# EasyEDA Pro project ProDoc_ChisFlash-MBC5-Plus-v1.21_8M.epro

# Schematic ChisFlash-MBC5-Plus-v1.21
Board Name: ChisFlash-MBC5-Plus-v1.21; Create Date: 2024-12-11; Page Name: 1; Project Name: ChisFlash-MBC5（GBC烧录卡）2; Schematic Name: ChisFlash-MBC5-Plus-v1.21; Update Date: 2024-12-11; Company: 嘉立创EDA; Page Size: A4; Version: V1.0
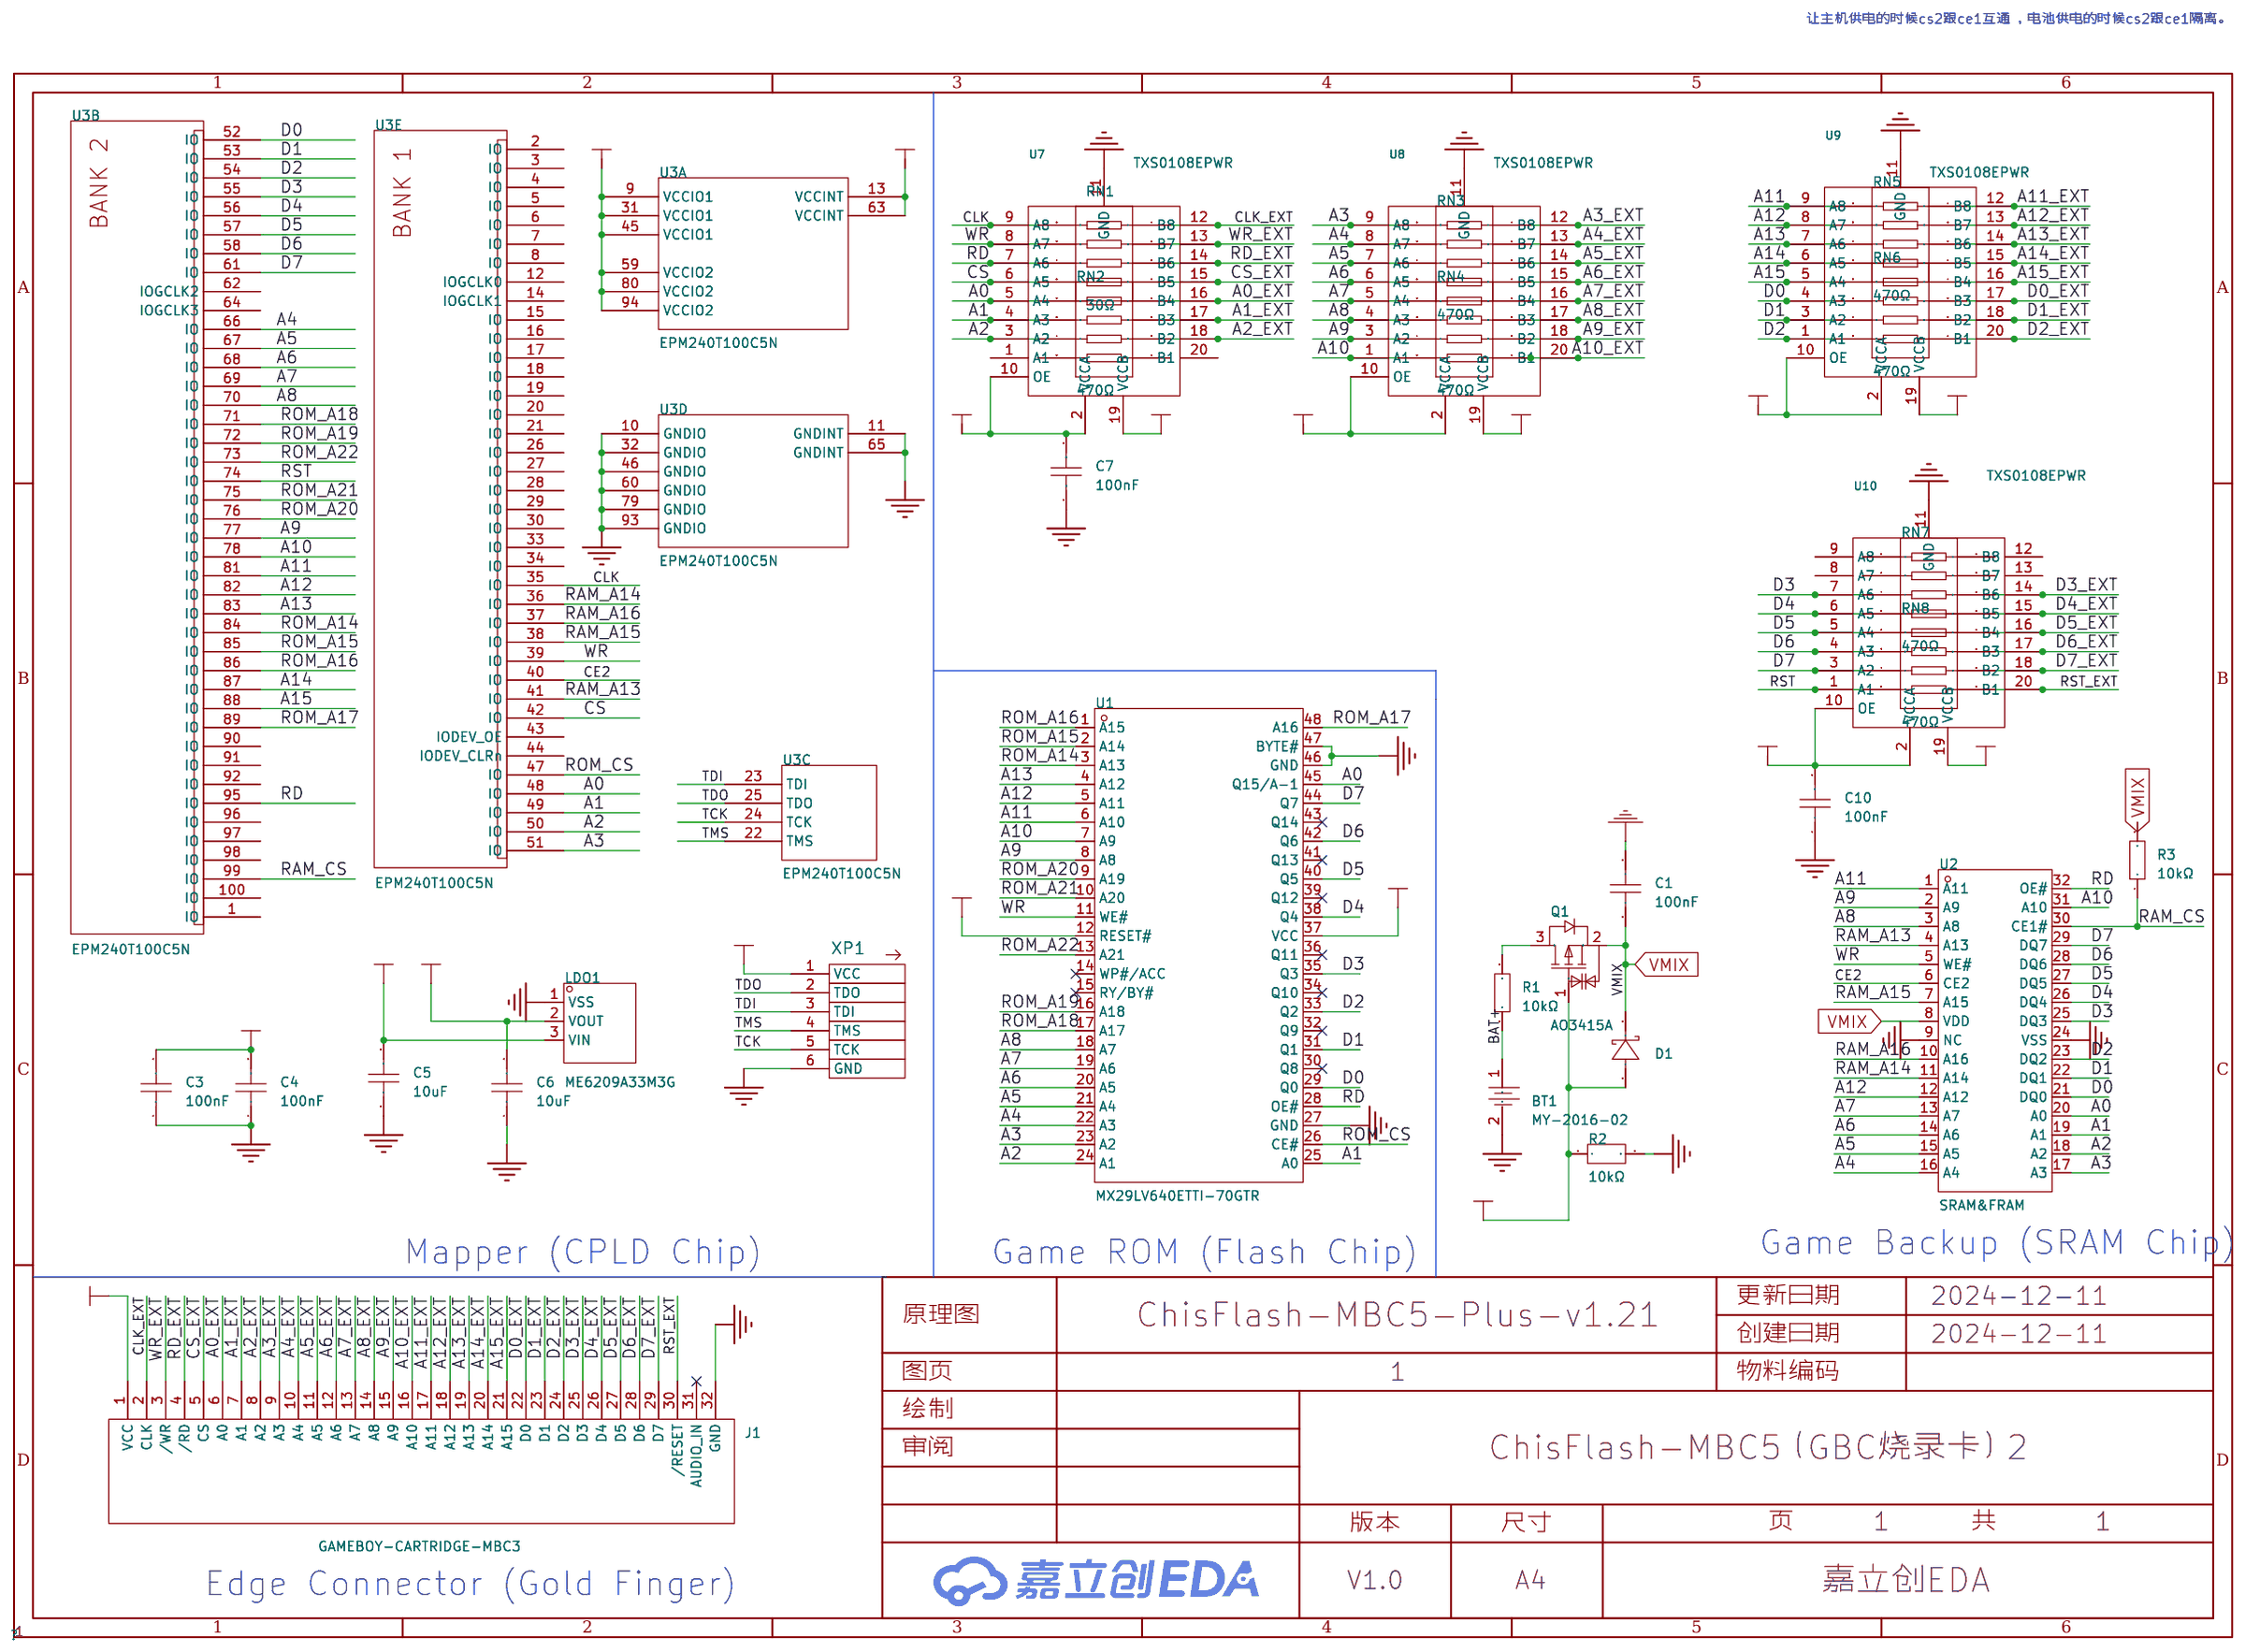
[diagram p0: schematic sheet]

## Parts
BT1  MY-2016-02  [BAT-SMD_MY-2032-08]
C1  100nF  [C0603]
C3  100nF  [C0603]
C4  100nF  [C0603]
C5  10uF  [C0603]
C6  10uF  [C0603]
C7  100nF  [C0603]
C10  100nF  [C0603]
D1  RB751V-40  [SOD-323_L1.7-W1.3-LS2.6-RD-1]
J1  GAMEBOY-CARTRIDGE-MBC3  [GAMEBOY_CARTRIDGE_PIN]
LDO1  ME6209A33M3G  [SOT-23-3_L2.9-W1.6-P1.90-LS2.8-BR]
Q1  AO3415A  [SOT-23-3_L3.0-W1.7-P0.95-LS2.9-BR]
R1  10kΩ  [R0603]
R2  10kΩ  [R0603]
R3  10kΩ  [R0603]
RN1  30Ω  [RES-ARRAY-SMD_0402-8P-L2.0-W1.0-BL]
RN2  470Ω  [RES-ARRAY-SMD_0402-8P-L2.0-W1.0-BL]
RN3  470Ω  [RES-ARRAY-SMD_0402-8P-L2.0-W1.0-BL]
RN4  470Ω  [RES-ARRAY-SMD_0402-8P-L2.0-W1.0-BL]
RN5  470Ω  [RES-ARRAY-SMD_0402-8P-L2.0-W1.0-BL]
RN6  470Ω  [RES-ARRAY-SMD_0402-8P-L2.0-W1.0-BL]
RN7  470Ω  [RES-ARRAY-SMD_0402-8P-L2.0-W1.0-BL]
RN8  470Ω  [RES-ARRAY-SMD_0402-8P-L2.0-W1.0-BL]
U1  MX29LV640ETTI-70GTR  [TSOP-48_L12.0-W18.4-P0.50-LS20.0-BL]
U2  SRAM&FRAM  [TSSOP-TSOP二合一]
U3  EPM240T100C5N  [TQFP-100_L14.0-W14.0-P0.50-LS16.0-BL]  (sections 1,2,3,4,5)
U7  TXS0108EPWR  [TSSOP-20_L6.5-W4.4-P0.65-LS6.4-BL]
U8  TXS0108EPWR  [TSSOP-20_L6.5-W4.4-P0.65-LS6.4-BL]
U9  TXS0108EPWR  [TSSOP-20_L6.5-W4.4-P0.65-LS6.4-BL]
U10  TXS0108EPWR  [TSSOP-20_L6.5-W4.4-P0.65-LS6.4-BL]
XP1  JTAG  [HDR-TH_6P-P1.27-V-M-1]  (no BOM)

## Library data of the parts
BT1 = MY-2016-02: 连接器类型:电池扣;适用电池规格:CR2016;触头材质:磷青铜;触点电镀:镍;工作温度范围:-25℃~+85℃;; LCSC Part Name: 电池扣 适用电池:CR2016; Supplier Part: C2979176; Manufacturer: MYOUNG(美阳); Supplier Footprint: SMD; JLCPCB Part Class: Extended Part; Datasheet: https://atta.szlcsc.com/upload/public/pdf/source/20220302/E5D3505CBEA02A6D68587A503653AA7C.pdf; Supplier: LCSC; Connector Type: 电池扣; Battery Type: CR2016; Contact Material: 磷青铜; Contact Plating: 镍; Operating Temperature Range: -25℃~+85℃
C1 C3 C4 C7 C10 = CGA0603X7R104K500JT: 容值:100nF;精度:±10%;额定电压:50V;材质(温度系数):X7R;; LCSC Part Name: 100nF ±10% 50V; Supplier Part: C6119867; Manufacturer: HRE(芯声); Supplier Footprint: 0603; JLCPCB Part Class: Extended Part; Supplier: LCSC; Tolerance: ±10%; Voltage Rated: 50V; Temperature Coefficient: X7R
C5 C6 = CL10A106MA8NRNC: 容值:10uF;精度:±20%;额定电压:25V;材质(温度系数):X5R;; LCSC Part Name: 10uF ±20% 25V; Supplier Part: C96446; Manufacturer: SAMSUNG(三星); Supplier Footprint: 0603; JLCPCB Part Class: 基础库; Datasheet: https://atta.szlcsc.com/upload/public/pdf/source/20160218/1457707763339.pdf; Supplier: LCSC; Tolerance: ±20%; Voltage Rated: 25V; Temperature Coefficient: X5R
D1 = RB751V-40_C7502691: 二极管配置:独立式;正向压降(Vf):370mV@1mA;直流反向耐压(Vr):40V;平均整流电流(Io):30mA;; LCSC Part Name: 电压:40V 电流:30mA; Supplier Part: C7502691; Manufacturer: 宏迦橙; Supplier Footprint: SOD-323; JLCPCB Part Class: Extended Part; Datasheet: https://atta.szlcsc.com/upload/public/pdf/source/20230828/92E6C0C5321000DDFDA2BB61EC3C00B5.pdf; Supplier: LCSC; Diode Configuration: 独立式; Forward Voltage (Vf@If): 370mV@1mA; Reverse Voltage (Vr): 40V; Average Rectified Current (Io): 30mA; Reverse Leakage Current (Ir): 500nA; Peak forward surge current: 200mA
J1 = GAMEBOY-CARTRIDGE-MBC3
LDO1 = ME6209A33M3G: 输出类型:固定;最大输入电压:18V;输出电压:3.3V;最大输出电流:250mA;电源纹波抑制比(PSRR):-;输出极性:正极;; LCSC Part Name: 输入18V 输出3.3V 250mA; Supplier Part: C83508; Manufacturer: MICRONE(南京微盟); Supplier Footprint: SOT-23-3L; JLCPCB Part Class: 扩展库; Datasheet: https://atta.szlcsc.com/upload/public/pdf/source/20161212/1481539101152.pdf; Supplier: LCSC; Output Type: 固定; Maximum Input Voltage: 18V; Output Voltage: 3.3V; MAX Output Current: 250mA; Dropout Voltage: 80mV@(40mA); Output Polarity: 正极; Number of Outputs: 1
Q1 = AO3415A_C347479: 类型:P沟道;漏源电压(Vdss):20V;连续漏极电流(Id):4A;功率(Pd):350mW;导通电阻(RDS(on)@Vgs,Id):50mΩ@4.5V,4A;阈值电压(Vgs(th)@Id):1V@250uA;; LCSC Part Name: P沟道 耐压:20V 电流:4A; Supplier Part: C347479; Manufacturer: UMW(友台半导体); Supplier Footprint: SOT-23; JLCPCB Part Class: 扩展库; Datasheet: https://atta.szlcsc.com/upload/public/pdf/source/20231109/CCE52C768C334A854304A623E33B204A.pdf; Supplier: LCSC; Type: P沟道; Drain Source Voltage (Vdss): 20V; Continuous Drain Current (Id): 4A; Power Dissipation (Pd): 350mW; Drain Source On Resistance (RDS(on)@Vgs,Id): 50mΩ@4.5V,4A; Gate Threshold Voltage (Vgs(th)@Id): 1V@250uA
R1 R3 = 0603WAF1002T5E: 电阻类型:厚膜电阻;阻值:10kΩ;精度:±1%;功率:100mW;温度系数:±100ppm/℃;最大工作电压:75V;工作温度范围:-55℃~+155℃;; LCSC Part Name: 10kΩ ±1% 100mW; Supplier Part: C25804; Manufacturer: UNI-ROYAL(厚声); Supplier Footprint: 0603; JLCPCB Part Class: Basic Part; Datasheet: https://atta.szlcsc.com/upload/public/pdf/source/20200306/C422600_1E6D84923E4A46A82E41ADD87F860B5C.pdf; Supplier: LCSC; Type: 厚膜电阻; Tolerance: ±1%; Power(Watts): 100mW; Temperature Coefficient: ±100ppm/℃; Overload Voltage (Max): 75V; Operating Temperature Range: -55℃~+155℃; Resistance: 47K
R2 = RT0603BRD1010KL: 电阻类型:薄膜电阻;阻值:10kΩ;精度:±0.1%;功率:100mW;最大工作电压:75V;温度系数:±25ppm/℃;; LCSC Part Name: 薄膜电阻 10kΩ ±0.1% 100mW; Supplier Part: C2087321; Manufacturer: YAGEO(国巨); Supplier Footprint: 0603; JLCPCB Part Class: 扩展库; Datasheet: https://atta.szlcsc.com/upload/public/pdf/source/20200610/C326738_5639A9F1B6EB6E4AE2197577D3456E7F.pdf; Supplier: LCSC; Type: 薄膜电阻; Tolerance: ±0.1%; Power(Watts): 100mW; Overload Voltage (Max): 75V; Temperature Coefficient: ±25ppm/℃; Operating Temperature Range: -55℃~+155℃
RN1 = RC-MT08W300JT: 电阻器数:4;阻值:30Ω;精度:±5%;单个元件功率:62.5mW;温度系数:±200ppm/℃;; LCSC Part Name: 30Ω ±5%; Supplier Part: C2007; Manufacturer: FH(风华); Supplier Footprint: 0402x4; JLCPCB Part Class: Extended Part; Datasheet: https://atta.szlcsc.com/upload/public/pdf/source/20140224/1457706855019.pdf; Supplier: LCSC; Number of Resistors: 4; Tolerance: ±5%; Power(Watts): 62.5mW; Temperature Coefficient: ±200ppm/℃; Number of Pins: 8
RN2-RN8 = EXB28V471JX: 电阻器数:4;阻值:470Ω;精度:±5%;单个元件功率:63mW;温度系数:±200ppm/℃;; LCSC Part Name: 470Ω ±5%; Supplier Part: C192511; Manufacturer: PANASONIC(松下); Supplier Footprint: 0402x4; JLCPCB Part Class: 扩展库; Datasheet: https://atta.szlcsc.com/upload/public/pdf/source/20180621/C194232_E41FA2194A84B71717DF19F1E7C5B3BB.pdf; Supplier: LCSC; Number of Resistors: 4; Tolerance: ±5%; Power(Watts): 63mW; Temperature Coefficient: ±200ppm/℃; Number of Pins: 8
U1 = MX29LV640ETTI-70GTR: Supplier Part: C2802730; Manufacturer: MXIC(旺宏电子); JLCPCB Part Class: 扩展库; Supplier: LCSC
U2 = SRAM&FRAM
U3 = EPM240T100C5N: 类型:其它PLD;逻辑门数量:-;逻辑单元数:-;逻辑阵列块数:240;; Supplier Part: C10041; Manufacturer: Intel/Altera; Supplier Footprint: TQFP-100(14x14); JLCPCB Part Class: 扩展库; Datasheet: https://atta.szlcsc.com/upload/public/pdf/source/20121123/1457706563537.pdf; Supplier: LCSC; Type: 其它PLD; Supply Voltage Range - VCCIO: 3.3V；2.5V; Logic Array Blocks: 240; Maximum Delay Time Tpd: 4.7ns; Operating Temperature Range: 0℃~+85℃
U7-U10 = TXS0108EPWR: 数据速率:60Mbps;电压(VCCA):1.4V~3.6V;电压(VCCB):1.65V~5.5V;电路数:1;每个电路通道数:8;; LCSC Part Name: 60Mbps 8位双向电平转换器; Supplier Part: C17206; Manufacturer: TI(德州仪器); Supplier Footprint: TSSOP-20; JLCPCB Part Class: 扩展库; Datasheet: http://www.ti.com/cn/lit/gpn/txs0108e; Supplier: LCSC; Channel Type: 双向; Data Rate: 60Mbps; Supply Voltage (VCCA): 1.4V~3.6V; Supply Voltage (VCCB): 1.65V~5.5V; Number of Circuits: 1; Channels per Circuit: 8; Output Type: 开路漏极；推挽式; Operating Temperature: -40℃~+85℃; Features: 自动方向检测
XP1 = jtag

## Nets
+3V3: C3.2 C4.2 C6.2 C7.2 C10.2 D1.2(A) LDO1.2(VOUT) Q1.1(G) R2.1 U1.12(RESET#) U1.37(VCC) U3.9(VCCIO1) U3.13(VCCINT) U3.31(VCCIO1) U3.45(VCCIO1) U3.59(VCCIO2) U3.63(VCCINT) U3.80(VCCIO2) U3.94(VCCIO2) U7.2(VCCA) U7.10(OE) U8.2(VCCA) U8.10(OE) U9.2(VCCA) U9.10(OE) U10.2(VCCA) U10.10(OE) XP1.1(VCC)
+5V: C5.2 J1.1(VCC) LDO1.3(VIN) U7.19(VCCB) U8.19(VCCB) U9.19(VCCB) U10.19(VCCB)
GND: BT1.2 C1.1 C3.1 C4.1 C5.1 C6.1 C7.1 C10.1 J1.32(GND) LDO1.1(VSS) R2.2 U1.27(GND) U1.46(GND) U1.47(BYTE#) U2.9(NC) U2.24(VSS) U3.10(GNDIO) U3.11(GNDINT) U3.32(GNDIO) U3.46(GNDIO) U3.60(GNDIO) U3.65(GNDINT) U3.79(GNDIO) U3.93(GNDIO) U7.11(GND) U8.11(GND) U9.11(GND) U10.11(GND) XP1.6(GND)
A0: RN2.5 U1.45(Q15/A-1) U2.20(A0) U3.48(IO) U7.5(A4)
A0_EXT: J1.6(A0) RN2.4 U7.16(B4)
A1: RN2.6 U1.25(A0) U2.19(A1) U3.49(IO) U7.4(A3)
A1_EXT: J1.7(A1) RN2.3 U7.17(B3)
A2: RN2.7 U1.24(A1) U2.18(A2) U3.50(IO) U7.3(A2)
A2_EXT: J1.8(A2) RN2.2 U7.18(B2)
A3: RN3.5 U1.23(A2) U2.17(A3) U3.51(IO) U8.9(A8)
A3_EXT: J1.9(A3) RN3.4 U8.12(B8)
A4: RN3.6 U1.22(A3) U2.16(A4) U3.66(IO) U8.8(A7)
A4_EXT: J1.10(A4) RN3.3 U8.13(B7)
A5: RN3.7 U1.21(A4) U2.15(A5) U3.67(IO) U8.7(A6)
A5_EXT: J1.11(A5) RN3.2 U8.14(B6)
A6: RN3.8 U1.20(A5) U2.14(A6) U3.68(IO) U8.6(A5)
A6_EXT: J1.12(A6) RN3.1 U8.15(B5)
A7: RN4.5 U1.19(A6) U2.13(A7) U3.69(IO) U8.5(A4)
A7_EXT: J1.13(A7) RN4.4 U8.16(B4)
A8: RN4.6 U1.18(A7) U2.3(A8) U3.70(IO) U8.4(A3)
A8_EXT: J1.14(A8) RN4.3 U8.17(B3)
A9: RN4.7 U1.8(A8) U2.2(A9) U3.77(IO) U8.3(A2)
A9_EXT: J1.15(A9) RN4.2 U8.18(B2)
A10: RN4.8 U1.7(A9) U2.31(A10) U3.78(IO) U8.1(A1)
A10_EXT: J1.16(A10) RN4.1 U8.20(B1)
A11: RN5.5 U1.6(A10) U2.1(A11) U3.81(IO) U9.9(A8)
A11_EXT: J1.17(A11) RN5.4 U9.12(B8)
A12: RN5.6 U1.5(A11) U2.12(A12) U3.82(IO) U9.8(A7)
A12_EXT: J1.18(A12) RN5.3 U9.13(B7)
A13: RN5.7 U1.4(A12) U3.83(IO) U9.7(A6)
A13_EXT: J1.19(A13) RN5.2 U9.14(B6)
A14: RN5.8 U3.87(IO) U9.6(A5)
A14_EXT: J1.20(A14) RN5.1 U9.15(B5)
A15: RN6.5 U3.88(IO) U9.5(A4)
A15_EXT: J1.21(A15) RN6.4 U9.16(B4)
BAT+: BT1.1 R1.1
BATQ1: Q1.3(D) R1.2
CE2: U2.6(CE2) U3.40(IO)
CLK: RN1.5 U3.35(IO) U7.9(A8)
CLK_EXT: J1.2(CLK) RN1.4 U7.12(B8)
CS: RN1.8 U3.42(IO) U7.6(A5)
CS_EXT: J1.5(CS) RN1.1 U7.15(B5)
D0: RN6.6 U1.29(Q0) U2.21(DQ0) U3.52(IO) U9.4(A3)
D0_EXT: J1.22(D0) RN6.3 U9.17(B3)
D1: RN6.7 U1.31(Q1) U2.22(DQ1) U3.53(IO) U9.3(A2)
D1_EXT: J1.23(D1) RN6.2 U9.18(B2)
D2: RN6.8 U1.33(Q2) U2.23(DQ2) U3.54(IO) U9.1(A1)
D2_EXT: J1.24(D2) RN6.1 U9.20(B1)
D3: RN7.7 U1.35(Q3) U2.25(DQ3) U3.55(IO) U10.7(A6)
D3_EXT: J1.25(D3) RN7.2 U10.14(B6)
D4: RN7.8 U1.38(Q4) U2.26(DQ4) U3.56(IO) U10.6(A5)
D4_EXT: J1.26(D4) RN7.1 U10.15(B5)
D5: RN8.5 U1.40(Q5) U2.27(DQ5) U3.57(IO) U10.5(A4)
D5_EXT: J1.27(D5) RN8.4 U10.16(B4)
D6: RN8.6 U1.42(Q6) U2.28(DQ6) U3.58(IO) U10.4(A3)
D6_EXT: J1.28(D6) RN8.3 U10.17(B3)
D7: RN8.7 U1.44(Q7) U2.29(DQ7) U3.61(IO) U10.3(A2)
D7_EXT: J1.29(D7) RN8.2 U10.18(B2)
RAM_A13: U2.4(A13) U3.41(IO)
RAM_A14: U2.11(A14) U3.36(IO)
RAM_A15: U2.7(A15) U3.38(IO)
RAM_A16: U2.10(A16) U3.37(IO)
RAM_CS: R3.1 U2.30(CE1#) U3.99(IO)
RD: RN1.7 U1.28(OE#) U2.32(OE#) U3.95(IO) U7.7(A6)
RD_EXT: J1.4(/RD) RN1.2 U7.14(B6)
ROM_A14: U1.3(A13) U3.84(IO)
ROM_A15: U1.2(A14) U3.85(IO)
ROM_A16: U1.1(A15) U3.86(IO)
ROM_A17: U1.48(A16) U3.89(IO)
ROM_A18: U1.17(A17) U3.71(IO)
ROM_A19: U1.16(A18) U3.72(IO)
ROM_A20: U1.9(A19) U3.76(IO)
ROM_A21: U1.10(A20) U3.75(IO)
ROM_A22: U1.13(A21) U3.73(IO)
ROM_CS: U1.26(CE#) U3.47(IO)
RST: RN8.8 U3.74(IO) U10.1(A1)
RST_EXT: J1.30(/RESET) RN8.1 U10.20(B1)
TCK: U3.24(TCK) XP1.5(TCK)
TDI: U3.23(TDI) XP1.3(TDI)
TDO: U3.25(TDO) XP1.2(TDO)
TMS: U3.22(TMS) XP1.4(TMS)
VMIX: C1.2 D1.1(K) Q1.2(S) R3.2 U2.8(VDD)
WR: RN1.6 U1.11(WE#) U2.5(WE#) U3.39(IO) U7.8(A7)
WR_EXT: J1.3(/WR) RN1.3 U7.13(B7)

Not connected (* = marked no-connect by the designer): J1 31(AUDIO_IN)*; RN2 1 8; RN7 3 4 5 6; U1 14(WP#/ACC)* 15(RY/BY#)* 30(Q8)* 32(Q9)* 34(Q10)* 36(Q11)* 39(Q12)* 41(Q13)* 43(Q14)*; U3 1(IO) 2(IO) 3(IO) 4(IO) 5(IO) 6(IO) 7(IO) 8(IO) 12(IOGCLK0) 14(IOGCLK1) 15(IO) 16(IO) 17(IO) 18(IO) 19(IO) 20(IO) 21(IO) 26(IO) 27(IO) 28(IO) 29(IO) 30(IO) 33(IO) 34(IO) 43(IODEV_OE) 44(IODEV_CLRn) 62(IOGCLK2) 64(IOGCLK3) 90(IO) 91(IO) 92(IO) 96(IO) 97(IO) 98(IO) 100(IO); U7 1(A1) 20(B1); U10 8(A7) 9(A8) 12(B8) 13(B7)

## Notes on the sheet
- 让主机供电的时候cs2跟ce1互通 ，电池供电的时候cs2跟ce1隔离。
- Game Backup (SRAM Chip)
- Mapper (CPLD Chip)
- Game ROM (Flash Chip)
- Edge Connector (Gold Finger)

# Board ChisFlash-MBC5-Plus-v1.21
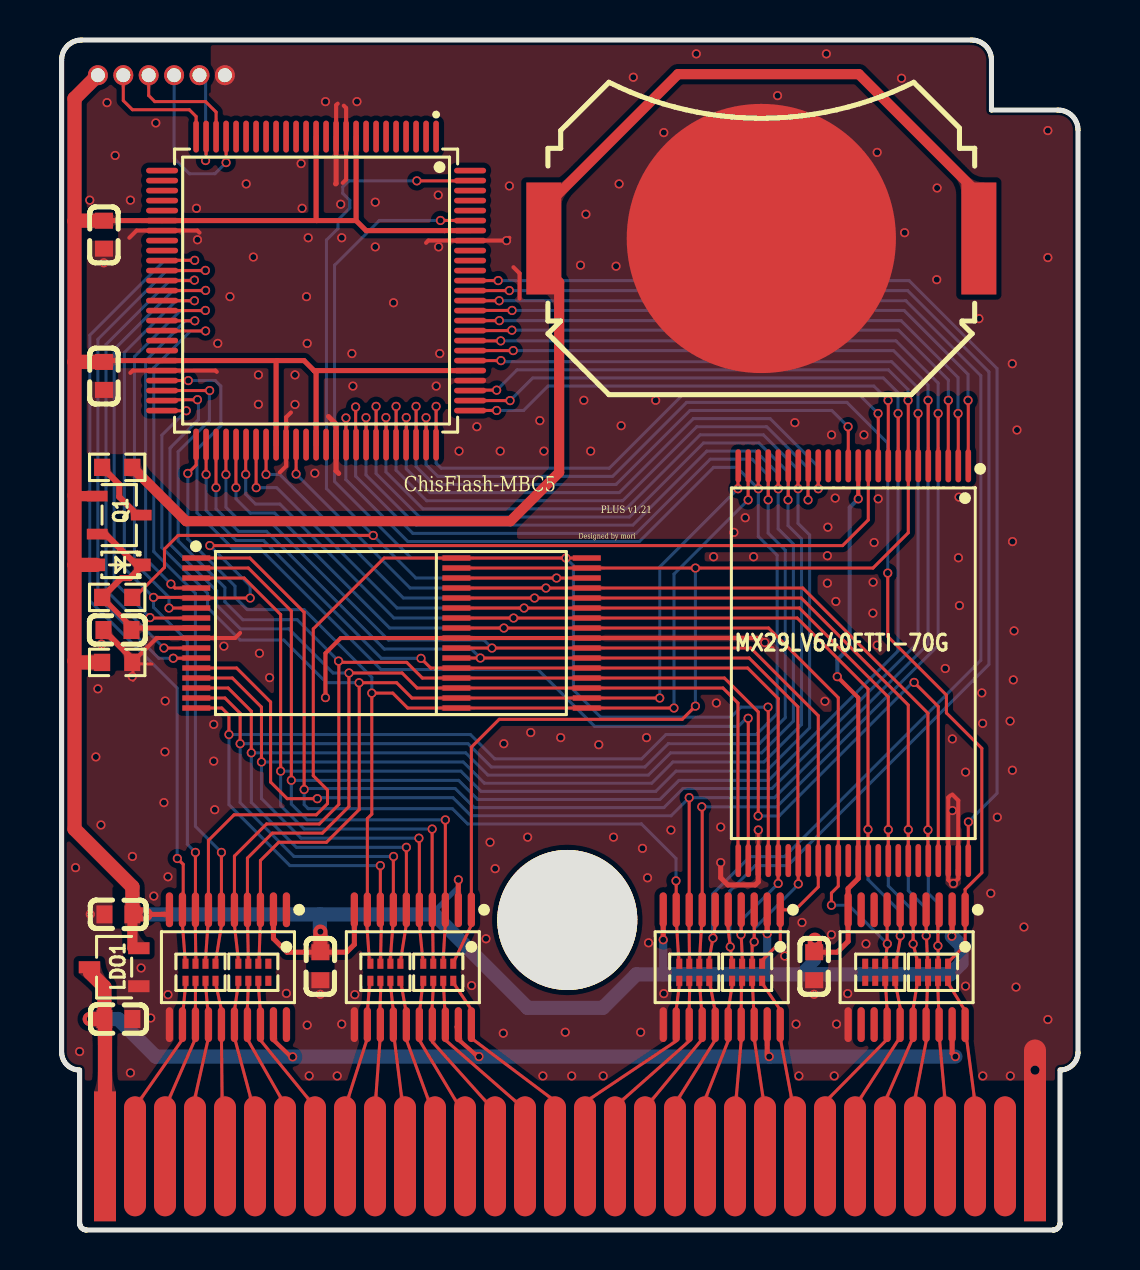
[diagram p1: board, top side]
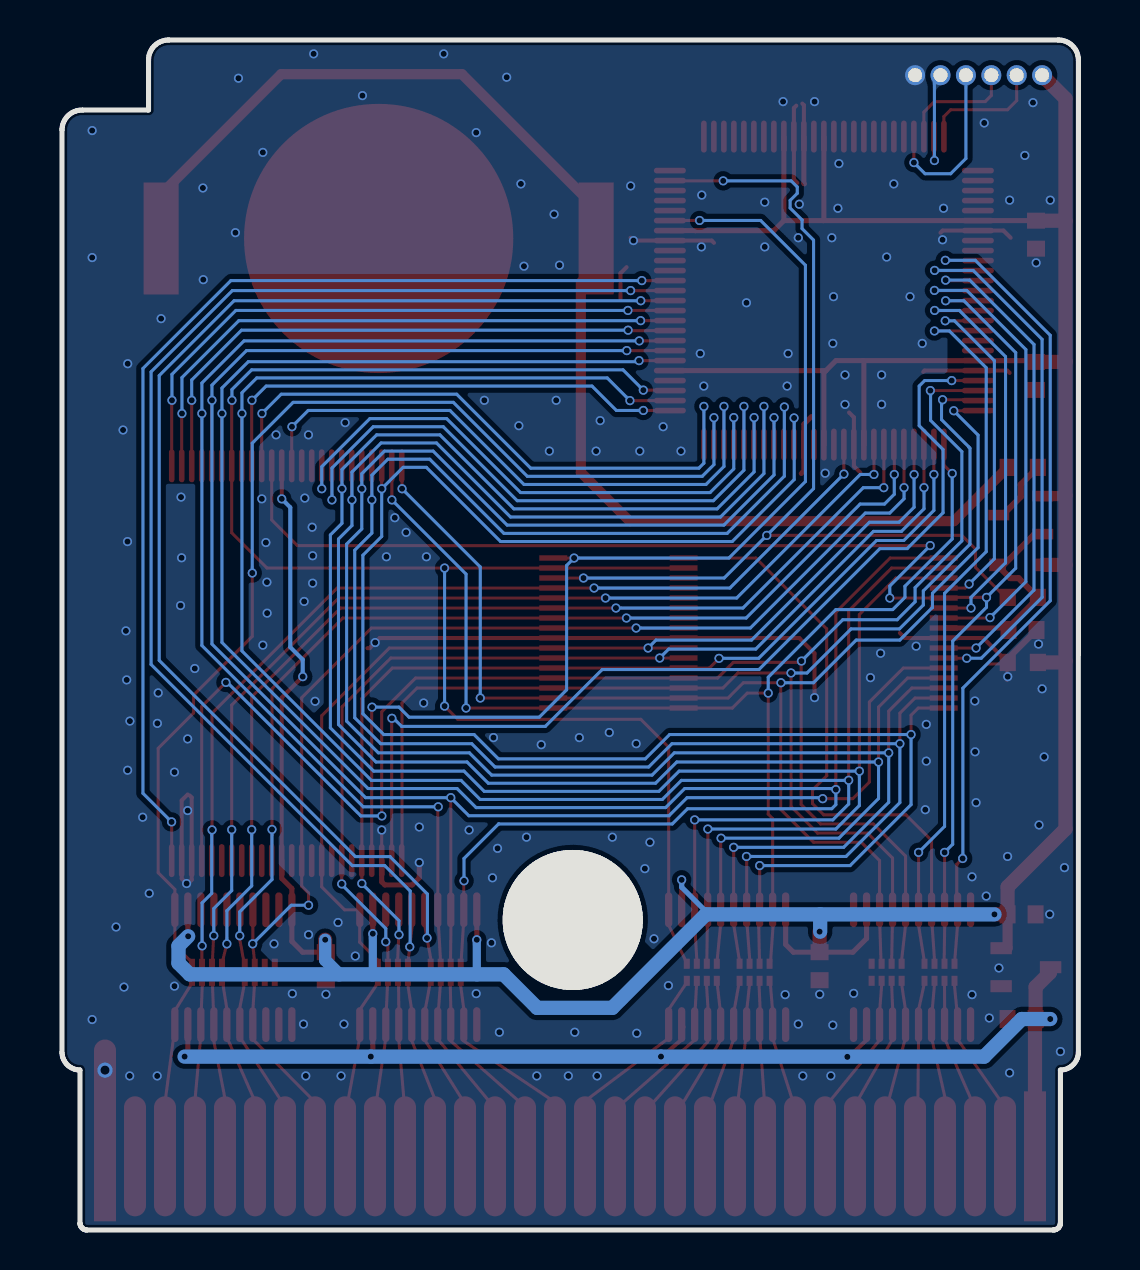
[diagram p2: board, bottom side, seen from below]

Outline 50.82 x 59.5 mm; copper layers: Top Layer, Bottom Layer. Coordinates in mm from the lower left corner of the outline.
Stack: Top Layer 0.035mm / Dielectric1 1.51mm FR4 er 4.5 / Bottom Layer 0.035mm

## Design rules (mm)
template: 自定义配置
spacing copperThickness1oz (default): track to track 0.254, other pairs 0.152 to 0.152
spacing copperThickness2oz: track to track 0.203, other pairs 0.152 to 0.3
track width copperThickness1oz (default): min 0.152, default 0.152, max 2.54
track width copperThickness2oz: min 0.203, default 0.254, max 2.54
differential pair differentialPair (default): width min 0.127, default 0.254, max 2.54; gap min 0.152, default 0.152
via viaSize (default): diameter min 0.457, default 0.457, max 10; hole min 0.3, default 0.305, max 6.299

## Placement (name value [footprint] x y rotation side)
BT1  MY-2016-02  [BAT-SMD_MY-2032-08]  34.99 49.58 180 top
C1  100nF  [C0603]  2.79 30 0 top
C3  100nF  [C0603]  2.12 49.77 90 top
C4  100nF  [C0603]  2.12 42.71 90 top
C5  10uF  [C0603]  2.84 10.55 180 top
C6  10uF  [C0603]  2.84 15.78 0 top
C7  100nF  [C0603]  12.94 13.19 90 top
C10  100nF  [C0603]  37.63 13.19 90 top
D1  RB751V-40  [SOD-323_L1.7-W1.3-LS2.6-RD-1]  2.9 33.26 180 top
J1  GAMEBOY-CARTRIDGE-MBC3  [GAMEBOY_CARTRIDGE_PIN]  25.28 15.5 0 top
LDO1  ME6209A33M3G  [SOT-23-3_L2.9-W1.6-P1.90-LS2.8-BR]  2.63 13.14 0 top
Q1  AO3415A  [SOT-23-3_L3.0-W1.7-P0.95-LS2.9-BR]  2.88 35.75 180 top
R1  10kΩ  [R0603]  2.78 38.13 180 top
R2  10kΩ  [R0603]  2.78 28.38 0 top
R3  10kΩ  [R0603]  2.78 31.63 180 top
RN1  30Ω  [RES-ARRAY-SMD_0402-8P-L2.0-W1.0-BL]  6.94 12.89 180 top
RN2  470Ω  [RES-ARRAY-SMD_0402-8P-L2.0-W1.0-BL]  9.59 12.89 180 top
RN3  470Ω  [RES-ARRAY-SMD_0402-8P-L2.0-W1.0-BL]  16.19 12.89 180 top
RN4  470Ω  [RES-ARRAY-SMD_0402-8P-L2.0-W1.0-BL]  18.83 12.89 180 top
RN5  470Ω  [RES-ARRAY-SMD_0402-8P-L2.0-W1.0-BL]  31.63 12.89 180 top
RN6  470Ω  [RES-ARRAY-SMD_0402-8P-L2.0-W1.0-BL]  34.28 12.89 180 top
RN7  470Ω  [RES-ARRAY-SMD_0402-8P-L2.0-W1.0-BL]  40.93 12.89 180 top
RN8  470Ω  [RES-ARRAY-SMD_0402-8P-L2.0-W1.0-BL]  43.57 12.89 180 top
U1  MX29LV640ETTI-70GTR  [TSOP-48_L12.0-W18.4-P0.50-LS20.0-BL]  39.58 28.34 180 top
U2  SRAM&FRAM  [TSSOP-TSOP二合一]  17.5 29.83 180 top
U3  EPM240T100C5N  [TQFP-100_L14.0-W14.0-P0.50-LS16.0-BL]  12.72 46.97 180 top
U7  TXS0108EPWR  [TSSOP-20_L6.5-W4.4-P0.65-LS6.4-BL]  8.32 13.14 180 top
U8  TXS0108EPWR  [TSSOP-20_L6.5-W4.4-P0.65-LS6.4-BL]  17.56 13.14 180 top
U9  TXS0108EPWR  [TSSOP-20_L6.5-W4.4-P0.65-LS6.4-BL]  33.01 13.14 180 top
U10  TXS0108EPWR  [TSSOP-20_L6.5-W4.4-P0.65-LS6.4-BL]  42.25 13.14 180 top
XP1  JTAG  [HDR-TH_6P-P1.27-V-M-1]  4.99 57.74 0 top

## Footprints (pads in the part's own frame, mm; a bottom-side part is the same pattern mirrored in y, then rotated)
BAT-SMD_MY-2032-08
  rect 1.75x5.6 smd: 1(-10.875,0) 1(10.875,0)
  round 13.462 smd: 2(0,0)
C0603
  rect 0.8x0.9 smd: 1(-0.7,0) 2(0.7,0)
GAMEBOY_CARTRIDGE_PIN
  round 7 hole 7: 0(0,0)
  rect 1.1x6.5 smd: 1(-23.114,-11.819) 32(23.386,-11.819)
  oval 1.1x6 smd: 2(-21.614,-11.819) 3(-20.114,-11.819) 4(-18.614,-11.819) 5(-17.114,-11.819) 6(-15.614,-11.819) 7(-14.114,-11.819) 8(-12.614,-11.819) 9(-11.114,-11.819) 10(-9.614,-11.819) 11(-8.114,-11.819) 12(-6.614,-11.819) 13(-5.114,-11.819) 14(-3.614,-11.819) 15(-2.114,-11.819) 16(-0.614,-11.819) 17(0.886,-11.819) 18(2.386,-11.819) 19(3.886,-11.819) 20(5.386,-11.819) 21(6.886,-11.819) 22(8.386,-11.819) 23(9.886,-11.819) 24(11.386,-11.819) 25(12.886,-11.819) 26(14.386,-11.819) 27(15.886,-11.819) 28(17.386,-11.819) 29(18.886,-11.819) 30(20.386,-11.819) 31(21.886,-11.819)
HDR-TH_6P-P1.27-V-M-1
  round 1 hole 0.7: 1(-3.175,0) 2(-1.905,0) 3(-0.635,0) 4(0.635,0) 5(1.905,0) 6(3.175,0)
R0603
  rect 0.806x0.864 smd: 1(-0.753,0) 2(0.753,0)
RES-ARRAY-SMD_0402-8P-L2.0-W1.0-BL
  rect 0.3x0.505 smd: 1(-0.75,0.427) 2(-0.25,0.427) 3(0.25,0.427) 4(0.75,0.427) 5(0.75,-0.427) 6(0.25,-0.427) 7(-0.25,-0.427) 8(-0.75,-0.427)
SOD-323_L1.7-W1.3-LS2.6-RD-1
  rect 0.83x0.63 smd: 1(-1.14,0) 2(1.14,0)
SOT-23-3_L2.9-W1.6-P1.90-LS2.8-BR
  rect 1.07x0.6 smd: 1(1.235,-0.95) 2(1.235,0.95) 3(-1.235,0)
SOT-23-3_L3.0-W1.7-P0.95-LS2.9-BR
  rect 1.038x0.532 smd: 1(1.101,-0.95) 2(1.101,0.95) 3(-1.101,0)
TQFP-100_L14.0-W14.0-P0.50-LS16.0-BL
  oval 0.28x1.6 smd: 1(-6,-7.7) 2(-5.5,-7.7) 3(-5,-7.7) 4(-4.5,-7.7) 5(-4,-7.7) 6(-3.5,-7.7) 7(-3,-7.7) 8(-2.5,-7.7) 9(-2,-7.7) 10(-1.5,-7.7) 11(-1,-7.7) 12(-0.5,-7.7) 13(0,-7.7) 14(0.5,-7.7) 15(1,-7.7) 16(1.5,-7.7) 17(2,-7.7) 18(2.5,-7.7) 19(3,-7.7) 20(3.5,-7.7) 21(4,-7.7) 22(4.5,-7.7) 23(5,-7.7) 24(5.5,-7.7) 25(6,-7.7) 51(6,7.7) 52(5.5,7.7) 53(5,7.7) 54(4.5,7.7) 55(4,7.7) 56(3.5,7.7) 57(3,7.7) 58(2.5,7.7) 59(2,7.7) 60(1.5,7.7) 61(1,7.7) 62(0.5,7.7) 63(0,7.7) 64(-0.5,7.7) 65(-1,7.7) 66(-1.5,7.7) 67(-2,7.7) 68(-2.5,7.7) 69(-3,7.7) 70(-3.5,7.7) 71(-4,7.7) 72(-4.5,7.7) 73(-5,7.7) 74(-5.5,7.7) 75(-6,7.7)
  oval 1.6x0.28 smd: 26(7.7,-6) 27(7.7,-5.5) 28(7.7,-5) 29(7.7,-4.5) 30(7.7,-4) 31(7.7,-3.5) 32(7.7,-3) 33(7.7,-2.5) 34(7.7,-2) 35(7.7,-1.5) 36(7.7,-1) 37(7.7,-0.5) 38(7.7,0) 39(7.7,0.5) 40(7.7,1) 41(7.7,1.5) 42(7.7,2) 43(7.7,2.5) 44(7.7,3) 45(7.7,3.5) 46(7.7,4) 47(7.7,4.5) 48(7.7,5) 49(7.7,5.5) 50(7.7,6) 76(-7.7,6) 77(-7.7,5.5) 78(-7.7,5) 79(-7.7,4.5) 80(-7.7,4) 81(-7.7,3.5) 82(-7.7,3) 83(-7.7,2.5) 84(-7.7,2) 85(-7.7,1.5) 86(-7.7,1) 87(-7.7,0.5) 88(-7.7,0) 89(-7.7,-0.5) 90(-7.7,-1) 91(-7.7,-1.5) 92(-7.7,-2) 93(-7.7,-2.5) 94(-7.7,-3) 95(-7.7,-3.5) 96(-7.7,-4) 97(-7.7,-4.5) 98(-7.7,-5) 99(-7.7,-5.5) 100(-7.7,-6)
TSOP-48_L12.0-W18.4-P0.50-LS20.0-BL
  oval 0.28x1.65 smd: 1(-5.75,-9.87) 2(-5.25,-9.87) 3(-4.75,-9.87) 4(-4.25,-9.87) 5(-3.75,-9.87) 6(-3.25,-9.87) 7(-2.75,-9.87) 8(-2.25,-9.87) 9(-1.75,-9.87) 10(-1.25,-9.87) 11(-0.75,-9.87) 12(-0.25,-9.87) 13(0.25,-9.87) 14(0.75,-9.87) 15(1.25,-9.87) 16(1.75,-9.87) 17(2.25,-9.87) 18(2.75,-9.87) 19(3.25,-9.87) 20(3.75,-9.87) 21(4.25,-9.87) 22(4.75,-9.87) 23(5.25,-9.87) 24(5.75,-9.87) 25(5.75,9.87) 26(5.25,9.87) 27(4.75,9.87) 28(4.25,9.87) 29(3.75,9.87) 30(3.25,9.87) 31(2.75,9.87) 32(2.25,9.87) 33(1.75,9.87) 34(1.25,9.87) 35(0.75,9.87) 36(0.25,9.87) 37(-0.25,9.87) 38(-0.75,9.87) 39(-1.25,9.87) 40(-1.75,9.87) 41(-2.25,9.87) 42(-2.75,9.87) 43(-3.25,9.87) 44(-3.75,9.87) 45(-4.25,9.87) 46(-4.75,9.87) 47(-5.25,9.87) 48(-5.75,9.87)
TSSOP-20_L6.5-W4.4-P0.65-LS6.4-BL
  oval 0.364x1.742 smd: 1(-2.925,-2.871) 2(-2.275,-2.871) 3(-1.625,-2.871) 4(-0.975,-2.871) 5(-0.325,-2.871) 6(0.325,-2.871) 7(0.975,-2.871) 8(1.625,-2.871) 9(2.275,-2.871) 10(2.925,-2.871) 11(2.925,2.871) 12(2.275,2.871) 13(1.625,2.871) 14(0.975,2.871) 15(0.325,2.871) 16(-0.325,2.871) 17(-0.975,2.871) 18(-1.625,2.871) 19(-2.275,2.871) 20(-2.925,2.871)
TSSOP-TSOP二合一
  rect 1.399x0.27 smd: 1(10.762,-3.769) 2(10.762,-3.269) 3(10.762,-2.769) 4(10.762,-2.269) 5(10.762,-1.769) 6(10.762,-1.269) 7(10.762,-0.769) 8(10.762,-0.269) 9(10.762,0.231) 10(10.762,0.731) 11(10.762,1.231) 12(10.762,1.731) 13(10.762,2.231) 14(10.762,2.731) 15(10.762,3.231) 16(10.762,3.731) 17(-8.763,3.731) 17(-2.243,3.731) 18(-8.763,3.231) 18(-2.243,3.231) 19(-8.763,2.731) 19(-2.243,2.731) 20(-8.763,2.231) 20(-2.243,2.231) 21(-8.763,1.731) 21(-2.243,1.731) 22(-8.763,1.231) 22(-2.243,1.231) 23(-8.763,0.731) 23(-2.243,0.731) 24(-8.763,0.231) 24(-2.243,0.231) 25(-8.763,-0.269) 25(-2.243,-0.269) 26(-8.763,-0.769) 26(-2.243,-0.769) 27(-8.763,-1.269) 27(-2.243,-1.269) 28(-8.763,-1.769) 28(-2.243,-1.769) 29(-8.763,-2.269) 29(-2.243,-2.269) 30(-8.763,-2.769) 30(-2.243,-2.769) 31(-8.763,-3.269) 31(-2.243,-3.269) 32(-8.763,-3.769) 32(-2.243,-3.769)

## Nets
As in the schematic.

Pads without a net: J1 0 31; RN2 1 8; RN7 3 4 5 6; U1 14 15 30 32 34 36 39 41 43; U3 1 2 3 4 5 6 7 8 12 14 15 16 17 18 19 20 21 26 27 28 29 30 33 34 43 44 62 64 90 91 92 96 97 98 100; U7 1 20; U10 8 9 12 13

## Via types
v1: diameter 0.457, hole 0.305, Top Layer to Bottom Layer, 323 vias
v2: diameter 0.762, hole 0.457, Top Layer to Bottom Layer, 1 via
v3: diameter 0.508, hole 0.305, Top Layer to Bottom Layer, 2 vias

## Routing (per net, layer and track width the routed paths; a pad name or vN(x,y) marks a point on that pad's centre or on a via; arc(x,y) is an arc through that point)
+3V3: length 203.5
  Top Layer w0.203: v1(39.83,36.56) U1.12 ; v1(38.78,27.67) 39.83,26.62 U1.37
  Top Layer w0.254: U7.10 5.39,15.78 v3(4.2,15.78) ; U9.2 v1(35.28,14.82) ; U10.2 44.53,14.7 v1(44.51,14.69) ; U3.94 19.16,49.97 19.15,49.97 15.23,49.97 14.72,50.47 ; U9.10 v1(30.08,14.51) ; 12.62,42.97 U3.80 ; 12.62,42.97 12.12,43.47 10.76,43.47 ; 12.62,42.97 12.72,42.87 U3.63 ; U3.13 12.72,50.51 12.76,50.47 ; 10.76,43.47 10.72,43.43 U3.59 ; 10.76,43.47 U3.45 2.19,43.47 C4.2 ; U1.37 39.83,17.58 39.33,17.07 U10.10 39.33,14.43 38.79,13.89 C10.2 ; 12.76,50.47 U3.31 2.13,50.47 C3.2 ; 12.76,50.47 14.72,50.47 ; U8.10 14.64,14.28 14.25,13.89 C7.2 11.27,13.89 10.59,14.57 U7.2 ; 14.72,50.47 U3.9 ; U8.2 v1(19.84,17.51)
  Top Layer w0.508: 0.65,36.73 0.68,36.7 Q1.1 ; C6.2 3.54,14.09 LDO1.2
  Top Layer w0.711: 0.65,50.45 0.65,56.57 XP1.1 ; 0.65,50.45 0.65,43.42 ; 0.65,50.45 0.66,50.47 C3.2 ; 0.65,33.26 1.73,33.26 ; 0.65,33.26 0.65,28.46 ; 0.65,33.26 0.65,43.42 ; 0.65,28.46 0.72,28.38 R2.1 ; 0.65,28.46 0.65,20.05 3.54,17.16 C6.2 v3(4.2,15.78) ; C7.2 v1(12.94,14.92) ; 0.65,43.42 0.66,43.41 C4.2 ; v1(37.66,14.51) 37.66,13.92 C10.2
  Bottom Layer w0.203: v1(38.78,27.67) 38.78,28.52 39.41,29.14 39.41,36.13 v1(39.83,36.56)
  Bottom Layer w0.254: 18.63,15.78 18.63,15.93 19.84,17.14 v1(19.84,17.51)
  Bottom Layer w0.406: v1(30.08,14.51) 30.08,12.79 30.08,12.78 ; v1(35.28,14.82) 35.28,12.8 35.3,12.78
  Bottom Layer w0.61: v1(37.66,14.51) 37.66,13.49 36.95,12.78
  Bottom Layer w0.711: v1(44.51,14.69) 44.99,14.2 44.99,13.34 44.43,12.78 28.74,12.78 27.06,11.11 23.3,11.11 18.63,15.78 12.91,15.78 ; 12.91,15.78 12.91,14.92 ; 12.91,15.78 v3(4.2,15.78)
+5V: length 61.2
  Top Layer w0.203: 11.51,8.62 10.58,9.51 ; v1(20.87,8.67) 20.76,8.78 20.69,8.78 19.86,9.5 19.75,10.16 19.83,10.27 U8.19
  Top Layer w0.254: U10.19 44.53,8.83 v1(44.69,8.67) ; v1(35.38,8.67) 35.28,8.77 U9.19
  Top Layer w0.711: J1.1 2.17,10.52 ; 1.4,13.05 1.43,13.02 1.43,12.87 2.14,12.15 C5.2 v3(1.41,10.55)
  Bottom Layer w0.711: v3(1.41,10.55) 2.83,10.55 4.71,8.67 v1(20.87,8.67) v1(35.38,8.67) v1(44.69,8.67)
  vias: v1(11.55,8.66)
GND: length 83.1
  Top Layer w0.152: 3.56,28.35 3.58,27.48 ; U1.27 v1(34.83,20) ; 3.68,28.31 4.52,28.3
  Top Layer w0.203: 8.93,29.85 8.67,29.6 U2.9 4.75,29.6 3.62,28.47 ; 3.39,49.61 3.75,49.97 U3.32 6.79,49.97 6.89,49.87 ; 44.54,21.78 44.83,21.48 U1.47 44.83,17.57 v1(44.59,17.32) 44.52,17.32 44.33,17.51 U1.46 44.33,21.62 44.44,21.73 ; 11.47,40.88 11.22,40.64 U3.60 11.22,38.2 10.91,37.88 ; 7.76,42.91 7.69,42.97 U3.46 3.55,42.97 3.44,42.86 ; U3.11 13.72,56.24 13.8,56.32 ; 14.06,52.36 14.22,52.53 U3.10 14.22,56.1 14.11,56.22 ; 35.55,29.09 35.44,29.09 v1(35.16,29.37) 34.94,29.6 U2.24 U2.24 13.96,29.6 13.19,28.84 v1(13.19,26.62) ; 22.39,49.61 v1(22.25,49.47) U3.93 18.34,49.47 18.22,49.36 ; 22.59,48.14 22.9,47.84 22.9,46.57
  Top Layer w0.254: U3.11 13.72,52.33 13.7,52.31 ; U1.27 34.83,17.41 34.68,17.26 33.31,17.26 32.95,17.61 v1(32.95,18.37) ; 13.85,37.83 13.72,37.96 U3.65 13.72,40.29 13.35,40.67
  Top Layer w0.305: C1.1 3.53,28.56
  Top Layer w1.1: 48.67,8.97 v2(48.67,7.99) J1.32
  vias: v1(0.7,18.12) v1(0.9,8.92) v1(1.41,51.49) v1(1.43,15.79) v1(1.71,23.66) v1(1.81,27.06) v1(1.99,29.3) v1(1.97,20.25) v1(2.11,48.36) v1(2.27,56.37) v1(2.68,53.73) v1(3.44,51.49) v1(3.53,27.67) v1(3.44,7.86) v1(3.54,18.68) v1(3.97,13.1) v1(4.46,10.6) v1(4.61,16.7) v1(4.71,55.36) v1(5.12,21.37) v1(5.18,26.45) v1(5.17,23.91) v1(5.32,17.66) v1(5.32,11.77) v1(6.74,51.09) v1(6.79,49.51) v1(7.61,25.28) v1(7.61,23.45) v1(7.66,21.01) v1(7.81,44.33) v1(8.11,29.19) v1(8.42,46.67) v1(9.23,52.31) v1(9.59,48.65) v1(9.84,42.76) v1(9.84,41.28) v1(9.89,28.84) v1(10.4,27.62) v1(11.24,11.83) v1(11.67,42.76) v1(11.67,41.28) v1(11.97,53.32) v1(12.03,51.09) v1(12.33,49.61) v1(12.25,46.67) v1(12.28,44.33) v1(12.28,10.24) v1(12.38,7.71) v1(12.66,37.84) v1(12.93,11.79) v1(13.19,56.42) v1(13.78,7.7) v1(13.96,51.29) v1(14.01,49.61) v1(14.01,10.3) v1(14.51,43.82) v1(14.56,42.2) v1(14.66,11.77) v1(14.77,56.42) v1(15.68,51.39) v1(15.68,49.16) v1(16.6,46.36) v1(18.73,42.2) v1(18.83,51.75) v1(18.85,49.16) v1(18.91,43.82) v1(19.87,38.95) v1(20.5,12.22) v1(20.76,40.17) v1(21.22,14.56) v1(21.42,19.39) v1(21.68,18.07) v1(21.93,38.95) v1(22.11,24.32) v1(22.08,9.84) v1(22.39,52.21) v1(23.3,19.64) v1(23.45,24.88) v1(23.91,40.47) v1(24.12,38.95) v1(24.06,7.7) v1(24.95,24.62) v1(25.18,9.89) v1(25.5,7.7) v1(25.94,48.24) v1(26.11,41.49) v1(26.22,50.79) v1(26.45,38.95) v1(26.86,24.27) v1(27.08,7.7) v1(27.6,19.64) v1(27.72,48.19) v1(27.88,52.31) v1(27.98,40.22) v1(28.59,57.64) v1(28.95,9.89) v1(29.04,19.08) v1(29.25,24.62) v1(29.3,17.61) v1(29.35,14.36) v1(29.7,41.49) v1(30.11,54.87) v1(30.11,11.82) v1(30.47,20) v1(31.74,58.81) v1(32.6,33.66) v1(32.74,26.35) v1(32.95,20.15) v1(33.61,34.88) v1(34.18,35.62) v1(34.6,33.66) v1(35.8,56.72) v1(36.16,13.7) v1(36.66,40.37) v1(36.72,10.3) v1(36.87,7.7) v1(37.02,15.38) v1(37.62,11.79) v1(38.17,26.44) v1(38.24,58.81) v1(38.31,35.14) v1(38.29,33.71) v1(38.29,32.34) v1(38.5,39.76) v1(38.49,14.77) v1(38.63,7.7) v1(38.68,36.6) v1(38.71,31.43) v1(38.75,10.3) v1(39.3,11.82) v1(40.12,39.76) v1(40.22,14.31) v1(40.63,34.37) v1(40.57,32.39) v1(40.56,30.84) v1(40.78,53.88) v1(40.83,36.56) v1(40.78,29.24) v1(42,57.59) v1(42.15,49.87) v1(43.78,52.1) v1(43.76,47.52) v1(44.18,28.08) v1(44.54,24.56) v1(44.54,20.97) v1(44.87,36.65) v1(44.84,33.61) v1(44.89,31.23) v1(45.2,22.89) v1(45.2,12.19) v1(45.87,45.57) v1(46.01,26.86) v1(46.05,25.33) v1(46.06,7.7) v1(46.46,16.83) v1(46.79,20.64) v1(47.42,25.45) v1(47.44,7.7) v1(47.53,43.32) v1(47.54,34.42) v1(47.62,29.96) v1(47.59,27.51) v1(47.54,22.99) v1(47.72,12.15) v1(47.77,40) v1(48.12,15.15) v1(49.31,54.97) v1(49.31,48.62) v1(49.31,10.52)
A0: length 86.6
  Top Layer w0.152: v1(34.83,20.7) 34.83,20.71 34.83,25.91 33.14,27.6 U2.20 U2.20 18.04,27.6 17.25,28.38 13.86,28.38 ; 13.86,28.38 13.86,28.43 v1(13.85,28.45) ; 13.86,28.38 13.86,21.28 12.89,20.3 10.25,20.3 8.64,18.7 U7.5 ; v1(42.63,27.38) 43.83,26.17 43.83,18.64 ; 8.85,13.42 8.64,15.27 ; U3.48 v1(7.4,41.97)
  Bottom Layer w0.152: v1(13.85,28.45) 11.78,30.51 9.06,30.51 8.16,31.41 8.16,32.12 5.83,34.46 5.83,38.92 7.39,40.48 7.39,42.06 ; v1(34.83,20.7) 35.88,20.7 42.55,27.38 v1(42.63,27.38)
A0_EXT: length 5.1
  Top Layer w0.152: 8.84,12.32 8.65,11.01 ; 9.62,5.99 8.65,9.61
A1: length 66.8
  Top Layer w0.152: U3.49 5.07,41.52 v1(6.79,41.52) ; 9.34,13.41 9.3,15.31 ; 33.83,18.64 33.82,18.65 33.82,26.35 33.07,27.1 U2.19 U2.19 17.78,27.1 17.02,27.85 v1(14.37,27.85) 14.37,27.85 14.37,21.17 13.04,19.85 10.54,19.85 9.29,18.6 U7.4
  Bottom Layer w0.152: v1(14.37,27.85) 13.57,27.85 11.36,30.06 8.95,30.06 7.75,31.25 7.75,31.96 5.42,34.29 5.42,39.09 5.47,39.14 5.47,39.15 6.84,40.52 6.84,41.47 v1(6.79,41.52)
A1_EXT: length 5.3
  Top Layer w0.152: 9.34,12.37 9.28,10.95 ; 11.2,6.19 9.29,9.54
A2: length 67.1
  Top Layer w0.152: 33.83,38.38 33.82,38.36 v1(33.82,37.06) ; v1(29.91,26.6) U2.18 U2.18 17.51,26.6 16.75,27.36 v1(14.87,27.36) 14.88,27.36 14.88,21.03 13.24,19.39 10.86,19.39 9.94,18.47 U7.3 ; U3.50 5.03,40.97 v1(6.23,40.97) ; 9.93,15.35 9.87,13.41
  Bottom Layer w0.152: v1(29.91,26.6) 29.91,33.15 v1(33.82,37.06) ; v1(6.23,40.97) 5.01,39.75 5.01,34.12 7.3,31.84 7.3,31.13 8.93,29.5 11.11,29.5 13.24,27.36 v1(14.87,27.36)
A2_EXT: length 5.8
  Top Layer w0.152: 9.83,12.28 9.94,10.87 ; 12.68,6.14 9.92,9.52
A3: length 60.2
  Top Layer w0.152: v1(6.31,37.83) 6.72,38.24 U3.51 ; 15.39,13.39 15.25,15.39 ; 34.33,38.38 34.33,38.37 v1(34.33,36.51) ; U8.9 15.29,20.57 15.51,20.8 v1(15.51,26.85) 16.56,26.85 17.3,26.1 U2.17 U2.17 v1(30.62,26.1)
  Bottom Layer w0.152: v1(15.51,26.85) 15.51,27.64 12.13,31.02 9.28,31.02 8.67,31.63 8.67,32.19 6.31,34.55 v1(6.31,37.83) ; v1(30.62,26.1) 30.62,32.8 v1(34.33,36.51)
A3_EXT: length 4.7
  Top Layer w0.152: 14.24,6.3 15.25,9.48 ; 15.41,12.37 15.29,11
A4: length 89.3
  Top Layer w0.152: U3.66 14.22,39.28 v1(14.22,40.6) ; v1(8.37,24.77) 8.37,25.74 8.01,26.1 U2.16 ; v1(15.94,18.22) U8.8 ; v1(34.83,37.06) 34.83,38.38 ; 15.99,15.36 15.94,13.41
  Bottom Layer w0.152: v1(15.94,18.22) 11.42,18.22 8.37,21.27 v1(8.37,24.77) 20.44,24.77 21.65,23.56 29,23.56 30.21,24.77 34.73,24.77 35.78,25.82 35.78,33.74 34.83,34.68 v1(34.83,37.06) 33.76,38.13 32.6,38.13 28.89,34.43 17.31,34.43 14.21,37.52 14.21,40.6 v1(14.22,40.6)
A4_EXT: length 4.9
  Top Layer w0.152: 15.97,12.34 15.91,11.01 ; 15.66,5.97 15.92,9.56
A5: length 92.5
  Top Layer w0.152: v1(16.6,18.68) 16.59,18.67 U8.7 ; 16.57,15.34 16.43,13.45 ; v1(14.7,41.15) 14.7,39.3 U3.67 ; 35.33,38.38 35.33,36.52 v1(35.33,36.51) ; U2.15 8.17,26.6 8.93,25.84 v1(8.93,24.32)
  Bottom Layer w0.152: v1(16.6,18.68) 11.62,18.68 8.93,21.37 v1(8.93,24.32) 20.32,24.32 21.49,23.15 29.17,23.15 30.33,24.32 34.88,24.32 36.18,25.61 36.18,33.99 35.33,34.85 v1(35.33,36.51) 35.33,37.74 34.53,38.54 32.43,38.54 28.72,34.83 17.56,34.83 14.7,37.69 v1(14.7,41.15)
A5_EXT: length 5.2
  Top Layer w0.152: 17.12,5.66 16.64,9.54 ; 16.44,12.29 16.58,11
A6: length 92
  Top Layer w0.152: v1(15.22,40.62) 15.22,40.61 U3.68 ; 35.83,38.38 35.83,37.07 v1(35.83,37.06) ; 16.95,13.47 17.24,15.3 ; v1(9.48,23.86) 9.48,25.94 8.33,27.1 U2.14 ; U8.6 17.24,16.01 v1(17.24,19.13)
  Bottom Layer w0.152: v1(17.24,19.13) 11.74,19.13 9.48,21.39 v1(9.48,23.86) 20.2,23.86 21.32,22.75 29.34,22.75 30.45,23.86 35,23.86 36.59,25.45 36.59,34.3 35.83,35.06 v1(35.83,37.06) 35.83,37.81 34.7,38.95 32.26,38.95 28.56,35.25 17.73,35.25 15.22,37.75 v1(15.22,40.62)
A6_EXT: length 4.7
  Top Layer w0.152: 17.22,9.57 18.38,6.38 ; 16.98,12.29 17.2,11.04
A7: length 94.8
  Top Layer w0.152: v1(9.99,23.4) 9.99,26.15 8.54,27.6 U2.13 ; 15.72,41.18 U3.69 ; 36.33,38.38 36.33,36.52 v1(36.32,36.51) ; v1(17.87,19.59) 17.89,19.57 U8.5 ; 17.89,15.26 18.06,13.52
  Bottom Layer w0.152: v1(17.87,19.59) 11.97,19.59 9.99,21.57 v1(9.99,23.4) 20.08,23.4 21.14,22.34 29.5,22.34 30.57,23.4 35.12,23.4 37,25.28 37,34.55 36.32,35.22 v1(36.32,36.51) 36.32,37.9 34.87,39.35 32.09,39.35 28.39,35.65 17.89,35.65 15.72,37.82 v1(15.72,41.18)
A7_EXT: length 5.2
  Top Layer w0.152: 17.92,9.57 17.9,9.48 19.83,6.26 19.93,6.23 ; 18.06,12.36 17.92,11.08
A8: length 98.7
  Top Layer w0.152: v1(16.22,40.62) 16.22,40.61 U3.70 ; U2.3 9.13,32.6 10.95,30.77 v1(10.95,22.94) ; v1(18.53,20.05) 18.53,16.02 U8.4 ; 18.58,13.54 18.55,15.23 ; v1(36.82,37.06) 36.82,38.37 36.83,38.38
  Bottom Layer w0.152: v1(16.22,40.62) 16.22,37.91 18.06,36.06 28.23,36.06 31.93,39.76 35.09,39.76 36.82,38.03 v1(36.82,37.06) 36.82,35.33 37.4,34.75 37.4,25.11 35.24,22.94 30.72,22.94 29.71,21.93 20.97,21.93 19.96,22.94 v1(10.95,22.94) 10.95,21.22 12.13,20.05 v1(18.53,20.05)
A8_EXT: length 5.7
  Top Layer w0.152: 18.6,12.28 18.52,11.03 ; 18.55,9.55 18.54,9.4 21.32,6.31 21.47,6.3
A9: length 100.9
  Top Layer w0.152: v1(11.49,22.49) 11.49,30.95 9.34,33.1 U2.2 ; 41.83,38.38 41.83,40.82 v1(41.82,40.83) ; 19.08,13.51 19.18,15.23 ; v1(19.19,20.51) U8.3 ; v1(22.42,41.47) 20.43,41.47
  Bottom Layer w0.152: v1(19.19,20.51) 12.28,20.51 11.49,21.3 v1(11.49,22.49) 11.49,22.48 19.85,22.48 20.81,21.53 29.91,21.53 30.87,22.48 35.35,22.48 41.82,28.96 v1(41.82,40.83) 41.82,41.86 41.08,42.6 23.56,42.6 v1(22.42,41.47)
A9_EXT: length 6.1
  Top Layer w0.152: 22.9,6.34 22.81,6.33 19.23,9.46 19.23,9.54 ; 19.09,12.26 19.16,11.05
A10: length 82.3
  Top Layer w0.152: U2.31 U2.31 v1(31.69,33.1) 40.57,33.1 42.33,34.86 42.33,41.48 v1(42.32,41.49) ; 20.5,15.28 19.65,13.49 ; v1(31.69,26.2) 31.03,25.54 21.88,25.54 20.49,24.14 U8.1 ; U3.78 20.45,41.99 v1(21.75,41.99)
  Bottom Layer w0.152: v1(21.75,41.99) 22.77,43.01 41.34,43.01 42.32,42.02 v1(42.32,41.49) ; v1(31.69,33.1) v1(31.69,26.2)
A10_EXT: length 6.6
  Top Layer w0.152: 19.65,12.27 20.48,11.04 ; 20.55,9.54 24.63,6.47
A11: length 113.1
  Top Layer w0.152: 30.87,13.37 30.74,15.36 ; v1(42.82,40.83) 42.83,40.82 42.83,38.38 ; v1(30.72,17.46) 30.73,17.45 U9.9 ; v1(21.97,43.47) 20.43,43.47 U3.81 ; v1(12.13,22.02) 12.13,30.89 9.41,33.6 U2.1
  Bottom Layer w0.152: v1(30.72,17.46) 30.72,18.58 28.99,20.31 28.98,20.3 20.31,20.3 19.54,21.07 12.33,21.07 12.13,21.27 v1(12.13,22.02) 12.18,22.08 19.68,22.08 20.64,21.12 30.11,21.12 31.07,22.08 35.52,22.08 42.82,29.38 v1(42.82,40.83) 42.82,42.1 41.5,43.42 22.02,43.42 v1(21.97,43.47)
A11_EXT: length 6.6
  Top Layer w0.152: 30.9,12.36 30.73,11.05 ; 26.37,6.53 30.75,9.46
A12: length 93
  Top Layer w0.152: U2.12 8.75,28.1 10.45,26.4 10.45,22.4 11.28,21.57 v1(12.79,21.57) ; v1(43.32,41.49) 43.33,41.48 43.33,38.38 ; v1(31.38,21.62) U9.8 ; v1(22.58,43.97) 20.43,43.97 ; 31.4,13.37 31.37,15.46
  Bottom Layer w0.152: v1(12.79,21.57) 12.84,21.62 19.57,21.62 20.47,20.71 30.48,20.71 v1(31.38,21.62) 35.64,21.62 43.32,29.3 v1(43.32,41.49) 43.32,42.24 41.59,43.97 v1(22.58,43.97)
A12_EXT: length 5.8
  Top Layer w0.152: 31.41,12.34 31.38,11.03 ; 31.4,9.47 28.01,6.47
A13: length 62.1
  Top Layer w0.152: U3.83 20.44,44.46 v1(21.96,44.46) ; 43.83,38.38 43.83,38.39 v1(43.83,40.83) ; 31.89,13.46 32.01,15.41 ; v1(32.01,21.16) 32.03,21.14 U9.7
  Bottom Layer w0.152: v1(21.96,44.46) 41.72,44.46 43.83,42.35 v1(43.83,40.83) 43.83,29.23 35.76,21.16 v1(32.01,21.16)
A13_EXT: length 5.4
  Top Layer w0.152: 32.07,9.6 29.49,6.47 ; 31.9,12.33 32,10.99
A14: length 63.6
  Top Layer w0.152: U3.87 20.43,46.47 v1(21.88,46.47) ; 32.69,15.28 v1(32.57,14.6) 32.37,13.5
  Bottom Layer w0.152: 32.55,14.61 32.55,16.8 34.42,18.67 36.15,18.67 45.96,28.48 45.96,42.72 42.22,46.47 v1(21.88,46.47)
A14_EXT: length 5
  Top Layer w0.152: 32.42,12.31 32.67,10.96 ; 32.71,9.55 30.8,6.51
A15: length 64.5
  Top Layer w0.152: 33.51,13.47 v1(33.43,14.16) 33.3,15.31 ; U3.88 v1(22.39,46.97)
  Bottom Layer w0.152: v1(22.39,46.97) 42.3,46.97 46.37,42.91 46.37,28.28 36.31,18.22 34.68,18.22 33.41,16.95 33.41,14.21
A15_EXT: length 4.6
  Top Layer w0.152: 33.35,9.51 32.15,6.48 ; 33.54,12.31 33.34,11.02
BAT+: length 66.6
  Top Layer w0.508: 24.11,50.01 24.17,48.08 24.88,47.38 24.88,37.88 22.44,35.44 6.23,35.44 R1.1 ; 24.11,50.01 BT1.1 ; 24.11,50.01 24.11,51.08 30.82,57.79 39.86,57.79 45.86,51.8 BT1.1
BATQ1: length 3.3
  Top Layer w0.305: R1.2 2.88,37.28 2.88,36.66 3.8,35.75 Q1.3
CE2: length 21.3
  Top Layer w0.152: v1(7.19,45.98) 7.19,45.97 U3.40 ; v1(5.37,31.1) U2.6
  Bottom Layer w0.152: v1(5.37,31.1) 5.37,31.63 3.64,33.36 3.64,43.67 5.95,45.98 v1(7.19,45.98)
CLK: length 41.2
  Top Layer w0.152: U7.9 6.08,16.05 6.08,18.28 v1(5.79,18.58) ; 6.19,13.36 6.03,15.35 ; v1(6.65,48.49) 4.98,48.49 4.97,48.5
  Bottom Layer w0.152: v1(6.65,48.49) 5.16,48.49 1.41,44.74 1.41,31.46 5.78,27.09 5.78,18.59 v1(5.79,18.58)
CLK_EXT: length 5.7
  Top Layer w0.152: 3.69,6.17 6.07,9.57 ; 6.21,12.36 6.06,10.83
CS: length 36
  Top Layer w0.152: 8.02,15.39 7.71,13.47 ; v1(7.2,44.95) 5.04,44.95 U3.42 ; U7.6 v1(7.99,18.88)
  Bottom Layer w0.152: v1(7.99,18.88) 6.69,20.18 6.69,31.83 4.61,33.92 4.61,43.11 6.45,44.95 v1(7.2,44.95)
CS_EXT: length 5.2
  Top Layer w0.152: 7.69,12.38 8,10.96 ; 8.03,5.94 7.99,9.73
D0: length 50.9
  Top Layer w0.152: 33.98,14.78 U9.4 ; U3.52 v1(7.22,37.78) ; v1(17.97,28.58) 18.45,28.1 U2.21 U2.21 34.3,28.1 35.83,26.57 35.83,26.56 v1(35.83,17.33) ; 34.04,13.45 33.98,14.69
  Bottom Layer w0.152: v1(33.97,14.77) 33.97,15.47 v1(35.83,17.33) ; v1(7.22,37.78) 7.22,35.98 8.73,34.48 10.09,34.48 15.99,28.58 v1(17.97,28.58)
D0_EXT: length 4.8
  Top Layer w0.152: 33.99,9.57 33.68,6.05 ; 33.99,12.33 33.98,11.03
D1: length 53
  Top Layer w0.152: U3.53 7.72,39.27 v1(7.72,37.12) ; 34.63,16.01 v1(34.63,14.41) 34.53,14.3 RN6.7 ; U2.22 v1(20.94,28.6) U2.22 34.38,28.6 36.82,26.16 36.82,18.66 36.83,18.64 v1(36.83,17.31)
  Bottom Layer w0.152: v1(36.83,17.31) 36.83,17.27 34.63,15.07 v1(34.63,14.41) ; v1(7.72,37.12) 7.72,36.06 8.85,34.93 10.25,34.93 16.13,29.05 20.49,29.05 v1(20.94,28.6)
D1_EXT: length 4.7
  Top Layer w0.152: 34.54,12.3 34.6,11 ; 34.63,9.58 35.14,6.18
D2: length 52.9
  Top Layer w0.152: v1(8.22,37.77) 8.22,39.26 U3.54 ; U2.23 v1(21.52,29.1) U2.23 34.45,29.1 37.83,25.72 U1.33 37.83,17.16 36.69,16.01 U9.1 35.93,16.01 35.93,14.4 35.94,14.4 35.03,13.48 RN6.8
  Bottom Layer w0.152: v1(21.52,29.1) 21.12,29.5 16.34,29.5 10.45,35.39 8.96,35.39 8.22,36.14 v1(8.22,37.77)
D2_EXT: length 4.9
  Top Layer w0.152: 35.07,12.29 35.92,11.03 ; 35.94,9.58 36.56,6.25
D3: length 55.9
  Top Layer w0.152: 38.83,18.64 38.83,26.62 35.35,30.1 U2.25 v1(22.11,30.1) U2.25 ; v1(38.49,16.24) 38.49,16.85 38.83,17.19 U1.35 ; v1(41.29,14.31) 41.28,14.32 U10.7 ; v1(8.72,37.12) 8.72,39.27 U3.55 ; 41.18,13.39 41.29,14.33
  Bottom Layer w0.152: v1(22.11,30.1) 16.4,30.1 10.65,35.85 9.43,35.85 8.72,36.56 v1(8.72,37.12) ; v1(41.29,14.31) 39.36,16.24 v1(38.49,16.24)
D3_EXT: length 5.7
  Top Layer w0.152: 41.35,9.61 38.27,6.5 ; 41.27,11.05 41.19,12.35
D4: length 57.4
  Top Layer w0.152: v1(9.21,37.78) 9.21,39.25 U3.56 ; U10.6 41.93,16 v1(41.93,14.71) ; U2.26 v1(22.6,30.6) U2.26 36.78,30.6 40.32,27.06 v1(40.32,20.03) 40.32,18.65 40.33,18.64 ; 41.75,13.53 41.95,14.66
  Bottom Layer w0.152: v1(9.21,37.78) 9.21,36.79 9.69,36.3 10.91,36.3 16.61,30.6 v1(22.6,30.6) ; v1(40.32,20.03) 40.32,17.52 41.93,15.91 v1(41.93,14.71)
D4_EXT: length 5.4
  Top Layer w0.152: 41.94,11.08 41.69,12.32 ; 39.67,6.16 41.92,9.64
D5: length 58.2
  Top Layer w0.152: U3.57 9.72,37.12 v1(9.73,37.12) ; 42.77,13.53 42.59,14.25 ; 41.33,18.64 v1(41.33,20.02) 41.33,26.66 36.89,31.1 U2.27 v1(23.12,31.1) U2.27 ; v1(42.58,14.31) U10.5
  Bottom Layer w0.152: v1(42.58,14.31) 42.58,15.97 41.33,17.21 v1(41.33,20.02) ; v1(23.12,31.1) 16.77,31.1 10.75,37.12 v1(9.73,37.12)
D5_EXT: length 4.8
  Top Layer w0.152: 42.57,11.05 42.78,12.32 ; 42.58,9.64 41.16,6.39
D6: length 58
  Top Layer w0.152: 43.23,14.72 U10.4 ; v1(10.22,37.78) 10.22,39.27 U3.58 ; 42.33,18.64 v1(42.33,20.02) 42.33,26.25 36.98,31.6 U2.28 v1(23.64,31.6) U2.28 ; 43.3,13.49 43.24,14.65
  Bottom Layer w0.152: v1(43.23,14.72) 43.23,16.07 42.33,16.97 v1(42.33,20.02) ; v1(23.64,31.6) 17.09,31.6 10.91,37.78 v1(10.22,37.78)
D6_EXT: length 4.6
  Top Layer w0.152: 43.28,9.68 42.64,6.44 ; 43.25,11.05 43.3,12.31
D7: length 58.3
  Top Layer w0.152: U3.61 v1(11.72,37.8) ; U10.3 43.82,15.95 v1(43.82,14.21) 43.83,14.2 43.83,13.48 ; 43.33,18.64 43.32,18.65 v1(43.32,20.01) 43.32,25.84 37.06,32.1 U2.29 v1(24.22,32.1) U2.29
  Bottom Layer w0.152: v1(43.32,20.01) 43.33,19.99 43.33,16.83 43.82,16.35 v1(43.82,14.21) ; v1(11.72,37.8) 17.42,32.1 v1(24.22,32.1)
D7_EXT: length 4.5
  Top Layer w0.152: 43.88,9.66 44.16,6.56 ; 43.8,12.31 43.86,10.97
RAM_A13: length 18
  Top Layer w0.152: v1(6.66,45.46) 5.04,45.46 U3.41 ; v1(5.47,32.3) 5.66,32.1 U2.4
  Bottom Layer w0.152: v1(5.47,32.3) 4.2,33.56 4.2,43.47 6.2,45.46 v1(6.66,45.46)
RAM_A14: length 28.1
  Top Layer w0.152: U2.11 6.72,28.59 v1(5.58,28.59) ; 5.01,47.97 U3.36 7.18,47.97 v1(7.19,47.98)
  Bottom Layer w0.152: v1(5.58,28.59) 4.86,28.59 1.81,31.63 1.81,44.53 5.26,47.98 v1(7.19,47.98)
RAM_A15: length 24.4
  Top Layer w0.152: v1(7.2,46.98) 7.19,46.97 U3.38 ; v1(4.42,30.62) 4.44,30.6 U2.7
  Bottom Layer w0.152: v1(7.2,46.98) 5.58,46.98 2.63,44.03 2.63,32.41 v1(4.42,30.62)
RAM_A16: length 25.4
  Top Layer w0.152: U3.37 6.62,47.47 v1(6.64,47.49) ; U2.10 v1(5.12,29.1)
  Bottom Layer w0.152: v1(6.64,47.49) 5.43,47.49 2.22,44.28 2.22,32 v1(5.12,29.1)
RAM_CS: length 56
  Top Layer w0.152: U2.30 v1(24.75,32.6) U2.30 ; U3.99 20.41,52.46 v1(17.76,52.46) ; v1(15.58,34.73) 5.83,34.73 5.14,34.05 5.14,33.13 3.64,31.63 R3.1
  Bottom Layer w0.152: v1(24.75,32.6) 17.71,32.6 v1(15.58,34.73) 13.24,37.07 13.24,49.5 13.82,50.07 13.82,50.51 14.41,51.1 14.41,51.48 14.06,51.84 14.06,52.15 14.36,52.46 v1(17.76,52.46)
RD: length 92.7
  Top Layer w0.152: v1(18.94,50.48) 20.42,50.48 U3.95 ; 7.32,15.37 7.19,13.47 ; U7.7 7.34,19.48 8.62,20.76 12.74,20.76 13.29,21.32 13.29,22 12.58,22.71 12.58,30.06 16.13,33.6 U2.32 v1(25.22,33.6) U2.32 ; 35.33,18.64 35.33,26.13 v1(35.32,26.15)
  Bottom Layer w0.152: v1(18.94,50.48) 15.89,50.48 13.65,48.24 13.65,37.43 17.47,33.6 v1(25.22,33.6) 25.59,33.23 25.59,27.01 26.96,25.64 33.47,25.64 33.97,26.15 v1(35.32,26.15)
RD_EXT: length 5.1
  Top Layer w0.152: 6.56,6.12 7.36,9.7 ; 7.19,12.38 7.32,10.92
ROM_A14: length 29.1
  Top Layer w0.152: U3.84 22.5,44.97 v1(22.52,44.99) ; 44.33,38.38 v1(44.33,41.49)
  Bottom Layer w0.152: v1(44.33,41.49) 44.33,42.5 41.84,44.99 v1(22.52,44.99)
ROM_A15: length 29.8
  Top Layer w0.152: v1(21.89,45.47) 20.43,45.47 U3.85 ; v1(44.82,40.83) 44.83,40.82 44.83,38.38
  Bottom Layer w0.152: v1(44.82,40.83) 44.82,42.62 41.98,45.47 v1(21.89,45.47)
ROM_A16: length 30.6
  Top Layer w0.152: 45.33,38.38 45.33,41.48 v1(45.32,41.49) ; U3.86 20.43,45.98 v1(22.52,45.98)
  Bottom Layer w0.152: v1(22.52,45.98) 42.13,45.98 45.32,42.78 v1(45.32,41.49)
ROM_A17: length 53.2
  Top Layer w0.152: U3.89 v1(21.83,47.47) ; v1(45.34,20.4) 45.33,20.4 45.33,18.64
  Bottom Layer w0.152: v1(45.34,20.4) 46.77,21.84 46.77,43.08 42.38,47.47 v1(21.83,47.47)
ROM_A18: length 32.2
  Top Layer w0.152: v1(37.32,36.51) 37.32,38.37 37.33,38.38 ; v1(16.72,41.18) U3.71
  Bottom Layer w0.152: v1(37.32,36.51) 37.32,38.1 35.26,40.17 31.76,40.17 28.06,36.47 18.25,36.47 16.72,37.99 v1(16.72,41.18)
ROM_A19: length 30
  Top Layer w0.152: 37.83,38.38 37.83,38.38 v1(37.83,37.06) ; v1(17.23,40.62) 17.23,39.28 U3.72
  Bottom Layer w0.152: v1(37.83,37.06) 37.83,38.17 35.42,40.57 31.59,40.57 27.89,36.87 18.42,36.87 17.23,38.06 v1(17.23,40.62)
ROM_A20: length 24.8
  Top Layer w0.152: v1(41.32,41.49) 41.33,41.48 41.33,38.38 ; U3.76 20.43,40.98 v1(21.75,40.98)
  Bottom Layer w0.152: v1(21.75,40.98) 23.1,40.98 24.32,42.2 40.61,42.2 v1(41.32,41.49)
ROM_A21: length 31.3
  Top Layer w0.152: 18.72,41.18 U3.75 ; v1(40.82,40.83) 40.83,40.82 40.83,38.38
  Bottom Layer w0.152: v1(18.73,41.18) 18.73,38.34 18.98,38.09 27.38,38.09 31.08,41.79 39.86,41.79 v1(40.82,40.83)
ROM_A22: length 30.5
  Top Layer w0.152: 39.33,38.38 39.33,40.15 v1(39.32,40.17) ; U3.73 17.72,41.18 v1(17.72,41.18)
  Bottom Layer w0.152: v1(39.32,40.17) 38.51,40.98 31.42,40.98 27.72,37.28 18.62,37.28 17.72,38.18 v1(17.72,41.18)
ROM_CS: length 49
  Top Layer w0.152: v1(34.33,25.59) 34.33,25.58 34.33,18.64 ; U3.47 v1(6.34,42.47)
  Bottom Layer w0.152: v1(34.33,25.59) 34.24,25.59 33.83,25.18 26.66,25.18 23.81,28.02 15.97,28.02 9.93,34.07 8.56,34.07 6.77,35.86 6.77,39.02 7.96,40.22 7.96,42.2 7.69,42.47 v1(6.34,42.47)
RST: length 58.1
  Top Layer w0.152: U3.74 18.22,40.62 v1(18.22,40.62) ; RN8.8 44.32,13.38 45.18,14.24 U10.1 45.18,17.03 46.01,17.86 46.01,24.08 44.24,25.85 44.24,26.75 41.31,29.68 v1(41.31,32.85)
  Bottom Layer w0.152: v1(18.22,40.62) 18.22,38.27 18.81,37.68 27.55,37.68 31.25,41.39 39.26,41.39 41.31,39.34 v1(41.31,32.85)
RST_EXT: length 4.9
  Top Layer w0.152: 44.37,12.27 45.14,11.02 ; 45.22,9.79 45.67,6.38
TCK: length 5.6
  Top Layer w0.152: U3.24 7.22,53.5 v1(7.2,53.48)
  Bottom Layer w0.152: v1(7.2,53.48) 7.2,57.44 XP1.5
TDI: length 6
  Top Layer w0.152: U3.23 7.72,55.9 7.2,56.42 4.66,56.42 4.35,56.73 XP1.3
TDO: length 6.2
  Top Layer w0.152: XP1.2 3.08,56.47 3.54,56.02 6.39,56.02 6.72,55.68 U3.25
TMS: length 8.6
  Top Layer w0.152: U3.22 v1(8.22,53.37)
  Bottom Layer w0.152: XP1.4 5.62,53.58 6.39,52.82 7.67,52.82 v1(8.22,53.37)
VMIX: length 11.2
  Top Layer w0.254: R3.2 3.5,30.16 3.5,30 3.59,30.1 U2.8
  Top Layer w0.305: R3.2 2.99,32.6 3.41,32.6 4.07,33.26 3.73,33.26 2.19,34.8 Q1.2
WR: length 82.3
  Top Layer w0.152: v1(6.64,46.47) 5.04,46.47 5.03,46.48 ; v1(9.43,31.6) U2.5 6.7,31.63 v1(4.59,31.63) ; U7.8 v1(6.69,18.88) ; 40.33,38.38 40.33,35.51 39.05,34.22 v1(7.41,34.22) ; 6.68,15.44 6.72,13.35
  Bottom Layer w0.152: v1(7.41,34.22) 9.43,32.2 v1(9.43,31.6) ; v1(6.69,18.88) 6.28,19.29 6.28,29.45 4.59,31.14 v1(4.59,31.63) 3.13,33.09 3.13,43.87 5.73,46.47 v1(6.64,46.47)
WR_EXT: length 5.3
  Top Layer w0.152: 6.7,12.35 6.69,10.89 ; 5.14,6.01 6.68,9.55

## Copper pours and planes (outline as drawn; the poured copper is in the pictures)
GND on Top Layer: -1.23,60.64 52.31,60.64 52.31,-1.54 -1.23,-1.54
GND on Bottom Layer: -1.23,60.64 52.31,60.64 52.31,-1.54 -1.23,-1.54

Small or netless copper shapes (teardrops, artwork), in the pictures only: 625 on Top Layer, 163 on Bottom Layer

## Text on the board
Top Solder Mask Layer: Designed by mori | VCC | GND | TDO | TDI | TMS | TCK | Plus v1.21 | ChisFlash-MBC5
Top Silkscreen Layer: MX29LV640ETTI-70G | Designed by mori | PLUS v1.21 | ChisFlash-MBC5
